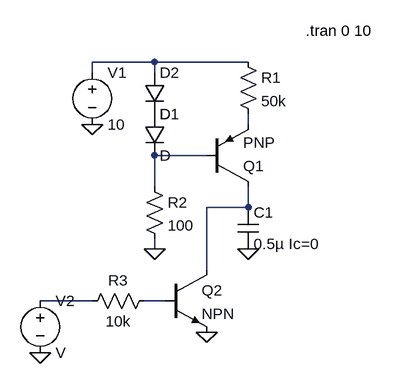
[diagram p0: schematic Ramp_generator.asc]
Ramp_generator.asc, the LTspice schematic file:
Version 4
SHEET 1 880 680
WIRE 240 128 144 128
WIRE 384 128 240 128
WIRE 144 144 144 128
WIRE 240 144 240 128
WIRE 384 224 384 208
WIRE 320 272 240 272
WIRE 240 320 240 272
WIRE 384 352 384 320
WIRE 384 352 320 352
WIRE 240 416 240 400
WIRE 320 448 320 352
WIRE 144 496 64 496
WIRE 256 496 224 496
FLAG 240 416 0
FLAG 144 224 0
FLAG 384 416 0
FLAG 320 544 0
FLAG 64 576 0
SYMBOL pnp 320 320 M180
SYMATTR InstName Q1
SYMBOL res 368 112 R0
SYMATTR InstName R1
SYMATTR Value 50k
SYMBOL res 224 304 R0
SYMATTR InstName R2
SYMATTR Value 100
SYMBOL diode 224 208 R0
SYMATTR InstName D1
SYMBOL diode 224 144 R0
SYMATTR InstName D2
SYMBOL cap 368 352 R0
SYMATTR InstName C1
SYMATTR Value 0.5µ Ic=0
SYMBOL voltage 144 128 R0
SYMATTR InstName V1
SYMATTR Value 10
SYMBOL npn 256 448 R0
SYMATTR InstName Q2
SYMBOL res 240 480 R90
WINDOW 0 0 56 VBottom 2
WINDOW 3 32 56 VTop 2
SYMATTR InstName R3
SYMATTR Value 10k
SYMBOL voltage 64 480 R0
SYMATTR InstName V2
TEXT 472 80 Left 2 !.tran 0 10

The netlist it stands for:
* Ramp_generator.asc
Q1 N004 N003 N002 0 PNP
R1 N001 N002 50k
R2 N003 0 100
D1 P001 N003 D
D2 N001 P001 D
C1 N004 0 0.5µ Ic=0
V1 N001 0 10
Q2 N004 N006 0 0 NPN
R3 N006 N005 10k
V2 N005 0 V
.model D D
.lib standard.dio
.model NPN NPN
.model PNP PNP
.lib standard.bjt
.tran 0 10
.backanno
.end